# EAGLE design RKJXT1 Board v6 (EAGLE 9.6.2)
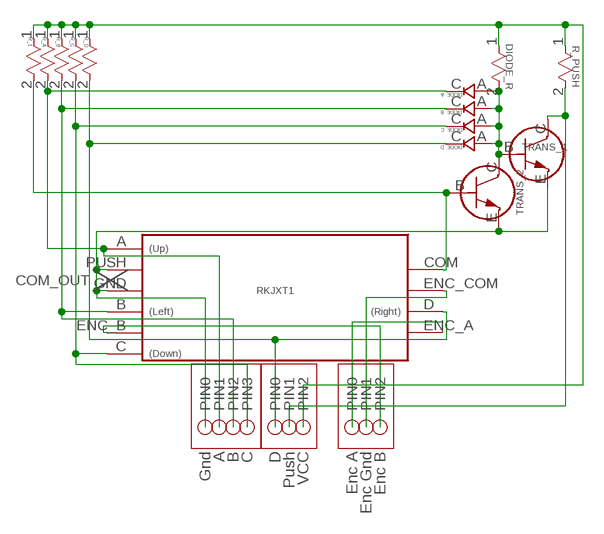
[diagram p0: schematic, sheet 1]

## Parts
DIODE_A  DIODE_SCHOTTKY_SMD_USC_TOS  [DIODE_SCHOTTKY_SMD_USC_TOS]
DIODE_B  DIODE_SCHOTTKY_SMD_USC_TOS  [DIODE_SCHOTTKY_SMD_USC_TOS]
DIODE_C  DIODE_SCHOTTKY_SMD_USC_TOS  [DIODE_SCHOTTKY_SMD_USC_TOS]
DIODE_D  DIODE_SCHOTTKY_SMD_USC_TOS  [DIODE_SCHOTTKY_SMD_USC_TOS]
DIODE_R  RESISTOR_1K_SMD_RNCP0805FTD1K00STA_RNCP0805_STP-L  [STA_RNCP0805_STP-L]
R_1  RESISTOR_1K_SMD_RNCP0805FTD1K00STA_RNCP0805_STP-L  [STA_RNCP0805_STP-L]
R_A  RESISTOR_1K_SMD_RNCP0805FTD1K00STA_RNCP0805_STP-L  [STA_RNCP0805_STP-L]
R_B  RESISTOR_1K_SMD_RNCP0805FTD1K00STA_RNCP0805_STP-L  [STA_RNCP0805_STP-L]
R_C  RESISTOR_1K_SMD_RNCP0805FTD1K00STA_RNCP0805_STP-L  [STA_RNCP0805_STP-L]
R_D  RESISTOR_1K_SMD_RNCP0805FTD1K00STA_RNCP0805_STP-L  [STA_RNCP0805_STP-L]
R_PUSH  RESISTOR_1K_SMD_RNCP0805FTD1K00STA_RNCP0805_STP-L  [STA_RNCP0805_STP-L]
RKJXT1  RKJXT1_V3  [RKJXT1_V3]
TRANS_1  TRANS_NPN_SMD_MMBT3904-TPSOT-23_MCC-L  [SOT-23_MCC-L]
TRANS_2  TRANS_NPN_SMD_MMBT3904-TPSOT-23_MCC-L  [SOT-23_MCC-L]
U$4  JST_ZH_3PIN_NO_GND  [JST_ZH_3PIN_NO_GND]
U$5  JST_ZH_3PIN_NO_GND  [JST_ZH_3PIN_NO_GND]
U$6  JST_ZH_4PIN  [JST_ZH_4PIN]

## Nets
A_OUT: DIODE_A.C R_A.2 RKJXT1.A U$6.PIN1
B_OUT: DIODE_B.C R_B.2 RKJXT1.B U$6.PIN2
C_OUT: DIODE_C.C R_C.2 RKJXT1.C U$6.PIN3
COM_OUT: RKJXT1.GND RKJXT1.PUSH TRANS_1.E TRANS_2.E U$6.PIN0
D_OUT: DIODE_D.C R_D.2 RKJXT1.D U$5.PIN0
ENC_A: RKJXT1.ENC_A U$4.PIN0
ENC_B: RKJXT1.ENC_B U$4.PIN2
ENC_COM: RKJXT1.ENC_COM U$4.PIN1
N$1: R_1.2 RKJXT1.COM TRANS_2.B
N$4: DIODE_A.A DIODE_B.A DIODE_C.A DIODE_D.A DIODE_R.2 TRANS_1.B TRANS_2.C
PUSH_OUT: R_PUSH.2 TRANS_1.C U$5.PIN1
VCC_OUT: DIODE_R.1 R_1.1 R_A.1 R_B.1 R_C.1 R_D.1 R_PUSH.1 U$5.PIN2

## Notes on the sheet
- COM_OUT
- Gnd | A | B | C | D | Push | VCC | Enc A | Enc Gnd | Enc B

## Library data of the parts
DIODE_A DIODE_B DIODE_C DIODE_D = Created Parts:DIODE_SCHOTTKY_SMD_USC_TOS
DIODE_R R_1 R_A R_B R_C R_D R_PUSH = Created Parts:RESISTOR_1K_SMD_RNCP0805FTD1K00; BUILT_BY: EMA_UL_Team; MANUFACTURER_PART_NUMBER: RNCP0805FTD1K00; RESISTANCE: 1K; SOURCELIBRARY: Stackpole_2014-12-31; VENDOR: Stackpole International
RKJXT1 = Created Parts:RKJXT1_V3: Multi-Directional Switches 4 drectnl swtch cntr push w/ an encoder Source: Datasheet <http://www.alps.com/prod/info/E/HTML/MultiControl/Switch/RKJXT/RKJXT1F42001.html>
TRANS_1 TRANS_2 = Created Parts:TRANS_NPN_SMD_MMBT3904-TP; BUILT_BY: EMA_Cory; COPYRIGHT: Copyright (C) 2018 Accelerated Designs. All rights reserved; MANUFACTURER_PART_NUMBER: MMBT3904-TP; SOURCELIBRARY: MCC_2019-12-03; VENDOR: Micro Commercial Co
U$4 = Created Parts:JST_ZH_3PIN_NO_GND; LABEL: Enc Pins; PIN0: EncA; PIN1: Com; PIN2: EncB
U$5 = Created Parts:JST_ZH_3PIN_NO_GND; LABEL: Label; PIN0: D; PIN1: Push; PIN2: Vcc
U$6 = Created Parts:JST_ZH_4PIN; LABEL: Hat Pins; PIN0: Gnd; PIN1: A; PIN2: B; PIN3: C

## Board
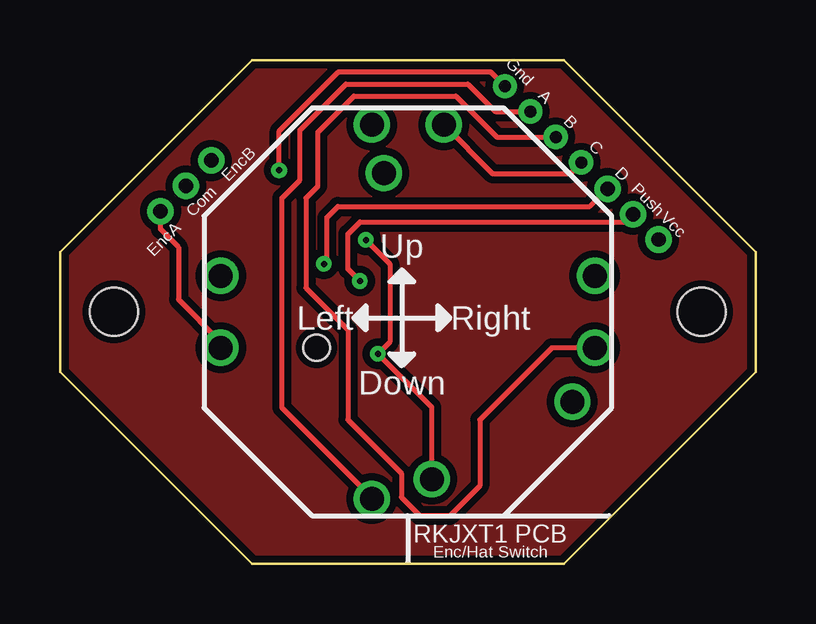
[diagram p1: board, top side]
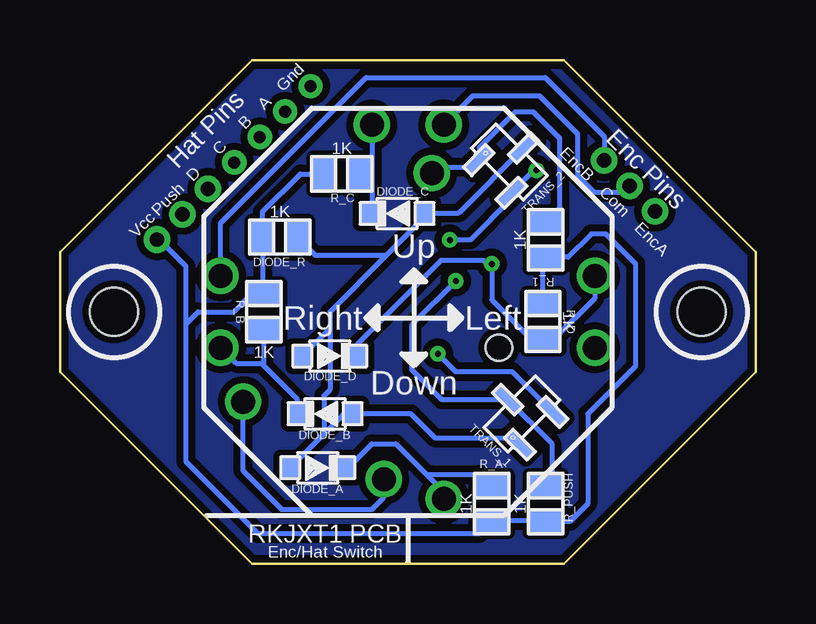
[diagram p2: board, bottom side, seen from below]

Size 29 x 21 mm. Coordinates in mm from the lower left corner, seen from the top.
Outline: 8,21 0,13 0,8 8,0 21,0 29,8 29,13 21,21 8,21
Copper layers (1*16): Top 0.035mm / dielectric 1.5mm / Bottom 0.035mm
Design rules ".20mm switch pcb": minimum track width 0.2mm, minimum drill 0.15mm, track to track 0.2mm, track to pad 0.2mm, pad to pad 0.2mm, via to via 0.2mm, smd to smd 0.2mm, copper to edge 0.2mm, drill to drill 0.2mm, minimum pad ring 10mil, minimum via ring 8mil, stop-mask expansion 4mil, vias tented up to drill 0mil, thermal gap 10mil
Holes 2 mm at 2.25,10.5 26.75,10.5

### Footprints (pad centres in the part's own frame; a part is rotated, then mirrored left to right if it is on the bottom)
DIODE_SCHOTTKY_SMD_USC_TOS = smd 0.8 x 0.9: A -1.15,0; C 1.15,0
STA_RNCP0805_STP-L = smd 0.913 x 1.347: 1 -0.723,0; 2 0.723,0
RKJXT1_V3 = drill 1 pad 1.5: A -1.5,-7.8; B 7.8,-1.5; C 1.5,7.8; COM -1,5.78; D -7.8,1.5; ENC_A -7.8,-1.5; ENC_B 7.8,1.5; ENC_COM -1.5,7.8; GND 6.86,-3.75; PUSH 1,-6.98 | hole 1.1: -3.8,-1.5
SOT-23_MCC-L = smd 0.528 x 1.289: B -0.959,-0.826; C 0,0.826; E 0.959,-0.826
JST_ZH_3PIN_NO_GND = drill 0.6: PIN0 -1.5,0; PIN1 0,0; PIN2 1.5,0
JST_ZH_4PIN = drill 0.5: PIN0 -2.25,0; PIN1 -0.75,0; PIN2 0.75,0; PIN3 2.25,0

### Placement (x,y rotation side)
DIODE_A  18.25,4 0 bottom
DIODE_B  17.95,6.25 180 bottom
DIODE_C  14.95,14.6 180 bottom
DIODE_D  17.75,8.65 0 bottom
DIODE_R  19.83,13.61 0 bottom
R_1  8.75,13.5 90 bottom
R_A  11,2.5 90 bottom
R_B  20.5,10.5 270 bottom
R_C  17.25,16.25 0 bottom
R_D  8.86,10.1 270 bottom
R_PUSH  8.75,2.5 90 bottom
RKJXT1  14.5,10.5 0 top
TRANS_1  9.75,6.25 45 bottom
TRANS_2  10.25,16.75 315 bottom
U$4  5.25,15.75 135 bottom
U$5  23.89,14.57 225 bottom
U$6  20.14,18.32 225 bottom

### Tracks (layer width: path | path; a pad name or v marks a point on that pad's centre or on a via)
A_OUT
  Top 0.2: RKJXT1.A 13,2.75 9.25,6.5 9.25,15.25 10,16 10,18.08 11.92,20 17,20 18.15,18.85 U$6.PIN1
  Bottom 0.2: DIODE_A.C 17,4 16,5 15,5 13.72,3.72 | 13.72,3.72 11.5,3.72 R_A.2 | 13.72,3.72 13,3 RKJXT1.A
B_OUT
  Top 0.2: RKJXT1.B 20.5,9 17.5,6 17.5,3.25 16.25,2 15,2 14.23,2.76 14.23,3.76 12,6 12,9.75 10.25,11.5 10.25,15.25 10.75,15.75 10.75,18 12.25,19.5 16.5,19.5 18.21,17.79 U$6.PIN2
  Bottom 0.2: RKJXT1.B 21.65,8.35 20.6,8.35 20.5,8.25 | DIODE_B.C 19.1,6.85 20.5,8.25 | 20.5,8.25 R_B.2
C_OUT
  Top 0.2: RKJXT1.C 18.05,16.25 21.25,16.25 U$6.PIN3
  Bottom 0.2: 16.03,14.67 DIODE_C.C 16,14.7 16,15.72 | R_C.2 16.53,16.27 | RKJXT1.C 16,16.78 | 16,16.78 16,15.72 | R_C.2 16,16.78 | R_C.2 16,15.72
COM_OUT  (via drill 0.25)
  Top 0.2: v12.75,13.5 13.75,12.5 13.75,9.25 v13.25,8.75 13.27,8.75 15.5,6.52 RKJXT1.PUSH | U$6.PIN0 17.96,20.5 11.6,20.5 9.14,18.04 v9.14,16.4
  Bottom 0.2: v12.75,13.5 11.89,13.5 10.16,15.24 TRANS_2.E 9.24,16.4 v9.14,16.4 | RKJXT1.PUSH 15.5,2.77 16.02,2.25 19.75,2.25 21.36,3.86 RKJXT1.GND | v13.25,8.75 12.5,8 10.14,8 TRANS_1.E
D_OUT  (via drill 0.25)
  Top 0.2: U$5.PIN0 22.09,14.89 11.59,14.89 11.12,14.41 11.12,12.62 v11,12.5
  Bottom 0.2: DIODE_D.C 16.6,9.15 13.1,12.65 11.36,12.65 11.21,12.5 v11,12.5 11,11 9.38,9.38 R_D.2 8.38,9.38 6.7,11.06 RKJXT1.D
ENC_A
  Top 0.2: U$4.PIN0 4.19,13.94 4.94,13.19 4.94,11.01 6.7,9.25 RKJXT1.ENC_A
ENC_B
  Bottom 0.2: RKJXT1.ENC_B 22.3,14.2 16.23,20.27 8.77,20.27 6.31,17.81 U$4.PIN2
ENC_COM
  Bottom 0.2: U$4.PIN1 5.5,15.5 6.75,15.5 7.41,16.16 7.41,17.91 9,19.5 11.8,19.5 RKJXT1.ENC_COM
GND
  pour Bottom (isolate 0.3): 0,13 8,21 21,21 29,13 29,8 21,0 8,0 0,8
  pour Top (isolate 0.3): 0,13 0,8 8,0 21,0 29,8 29,13 21,21 8,21
N$1
  Bottom 0.2: RKJXT1.COM 13.25,16.53 11.83,16.53 TRANS_2.B 11.51,17.34 10.03,18.83 9.25,18.83 8.17,17.75 8.17,14.83 8.75,14.25 R_1.2
N$4
  Bottom 0.2: 18.75,8.85 DIODE_D.A 17.75,9.8 | 15.39,12.86 18.36,12.86 DIODE_R.2 18.9,13.4 | TRANS_2.C 12.38,14.62 13.78,14.62 DIODE_C.A 13.8,14.45 15.39,12.86 | TRANS_1.B 10.11,5.25 13.37,5.25 14.37,6.25 DIODE_B.A 17.15,6.25 18,5.4 | 18,5.4 DIODE_A.A | 17.75,9.8 17.75,7.25 18,7 18,5.4 | 15.39,12.86 17.75,10.5 17.75,9.8
PUSH_OUT  (via drill 0.25)
  Top 0.2: v12.5,11.78 12,12.28 12,13.75 12.5,14.25 23.57,14.25 U$5.PIN1
  Bottom 0.2: R_PUSH.2 8.5,3.47 8.5,5 TRANS_1.C 13.08,6.83 14.33,8.08 14.33,9.94 v12.5,11.78
VCC_OUT
  Bottom 0.2: R_D.1 8.86,12.78 R_1.1 7.82,12.78 6.85,13.75 6.25,13.75 5,12.5 5,8.25 7,6.25 7,2.5 7.75,1.75 8.75,1.75 R_PUSH.1 R_A.1 11.53,1.25 20.75,1.25 23.75,4.25 23.75,10 | R_C.1 18.97,16.25 20.55,14.67 DIODE_R.1 20.55,11.28 R_B.1 21.03,11.22 21.75,10.5 23.25,10.5 23.75,10 | U$5.PIN2 24.87,13.51 23.75,12.39 23.75,10

### Text on the board
tPlace: Up | Left | Right | Down | RKJXT1 PCB | Enc/Hat Switch
bPlace: Up | Left | Right | Down | RKJXT1 PCB | Enc/Hat Switch